# EAGLE design laser-jog-controller-0 (EAGLE 6.6.0)
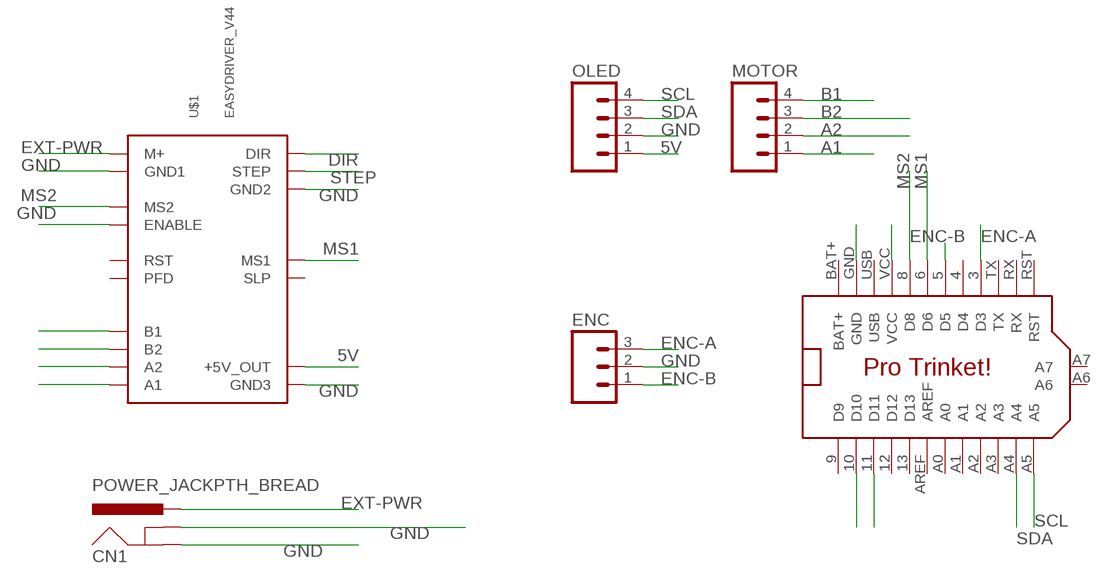
[diagram p0: schematic, sheet 1]

## Parts
CN1  POWER_JACKPTH_BREAD  [POWER_JACK_PTH_BREAD]
ENC  M03LOCK_LONGPADS  [1X03_LOCK_LONGPADS]
MOTOR  M04LOCK_LONGPADS  [1X04_LOCK_LONGPADS]
OLED  M04LOCK_LONGPADS  [1X04_LOCK_LONGPADS]
U$1  EASYDRIVER_V44  [EASYDRIVER_V44]
U$2  PRO_TRINKET  [PROTRINKET]

## Nets
5V: OLED.1 U$1.P$11(+5V_OUT) U$2.VCC
A1: MOTOR.1 U$1.A1
A2: MOTOR.2 U$1.A2
B1: MOTOR.4 U$1.B1
B2: MOTOR.3 U$1.B2
DIR: U$1.DIR U$2.11(D11)
ENC-A: ENC.3 U$2.3(D3)
ENC-B: ENC.1 U$2.5(D5)
EXT-PWR: CN1.PWR U$1.M+
GND: CN1.GND CN1.GNDBREAK ENC.2 OLED.2 U$1.ENABLE U$1.GND1 U$1.GND2 U$1.GND3 U$2.GND
MS1: U$1.MS1 U$2.6(D6)
MS2: U$1.MS2 U$2.8(D8)
SCL: OLED.4 U$2.A5
SDA: OLED.3 U$2.A4
STEP: U$1.STEP U$2.10(D10)
Unconnected: U$1.PFD U$1.RST U$1.SLEEP(SLP) U$2.4(D4) U$2.9(D9) U$2.12(D12) U$2.13(D13) U$2.A0 U$2.A1 U$2.A2 U$2.A3 U$2.A6 U$2.A7 U$2.AREF U$2.RST U$2.RX U$2.TX

## Power pins joined to a net without a drawn wire
BAT+: U$2.BAT+
USB: U$2.USB

## Library data of the parts
CN1 = SparkFun-Connectors:POWER_JACK: Power Jack This is the standard 5.5mm barrel jack for power. The PTH is the most common, proven, reliable, footprint. The Slot footprint only works if the mill layer is transmitted to the PCB fab house so be warned. Mating wall wart : TOL-00298 (and others); PROD_ID: PRT-10811
ENC = SparkFun-Connectors:M03: Header 3 Standard 3-pin 0.1" header. Use with straight break away headers (SKU : PRT-00116), right angle break away headers (PRT-00553), swiss pins (PRT-00743), machine pins (PRT-00117), and female headers (PRT-00115). Molex polarized connector foot print use with SKU : PRT-08232 with associated crimp pins and housings.
MOTOR OLED = SparkFun-Connectors:M04: Header 4 Standard 4-pin 0.1" header. Use with straight break away headers (SKU : PRT-00116), right angle break away headers (PRT-00553), swiss pins (PRT-00743), machine pins (PRT-00117), and female headers (PRT-00115). Molex polarized connector foot print use with SKU : PRT-08231 with associated crimp pins and housings. 1MM SMD Version SKU: PRT-10208
U$1 = EasyDriver:EASYDRIVER_V44: EasyDriver version 4.4 - http://www.schmalzhaus.com/EasyDriver
U$2 = adafruit:PRO_TRINKET

## Board
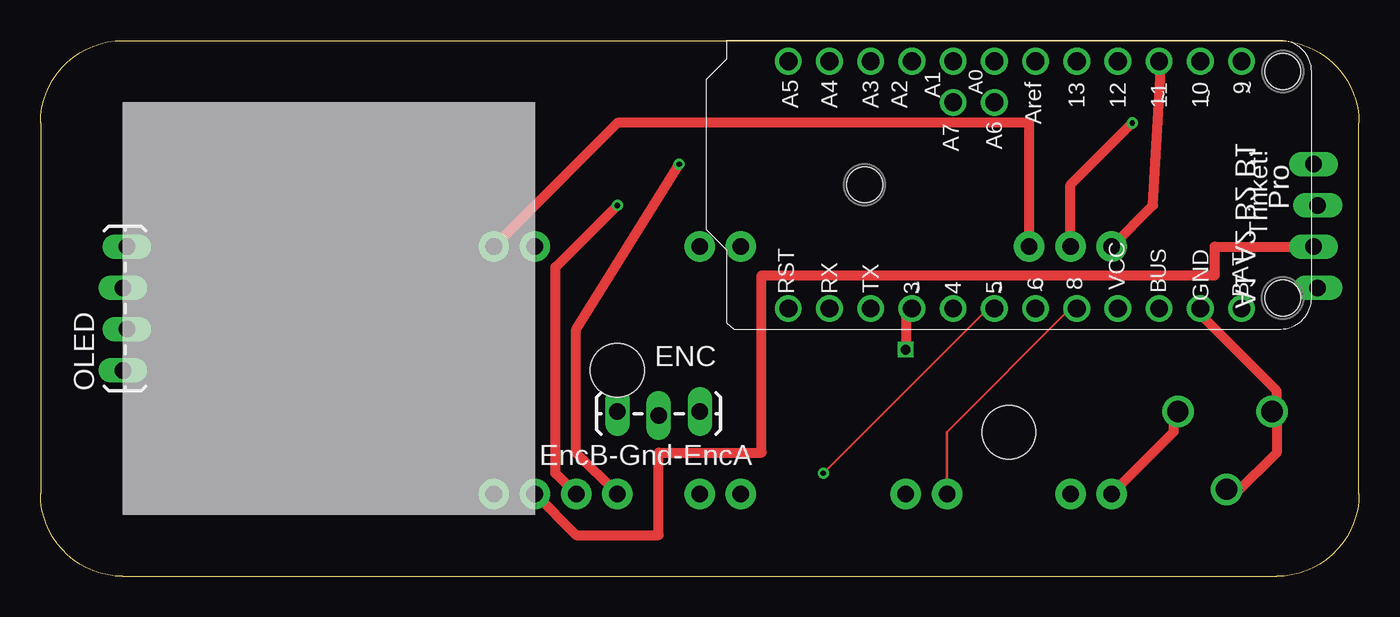
[diagram p1: board, top side]
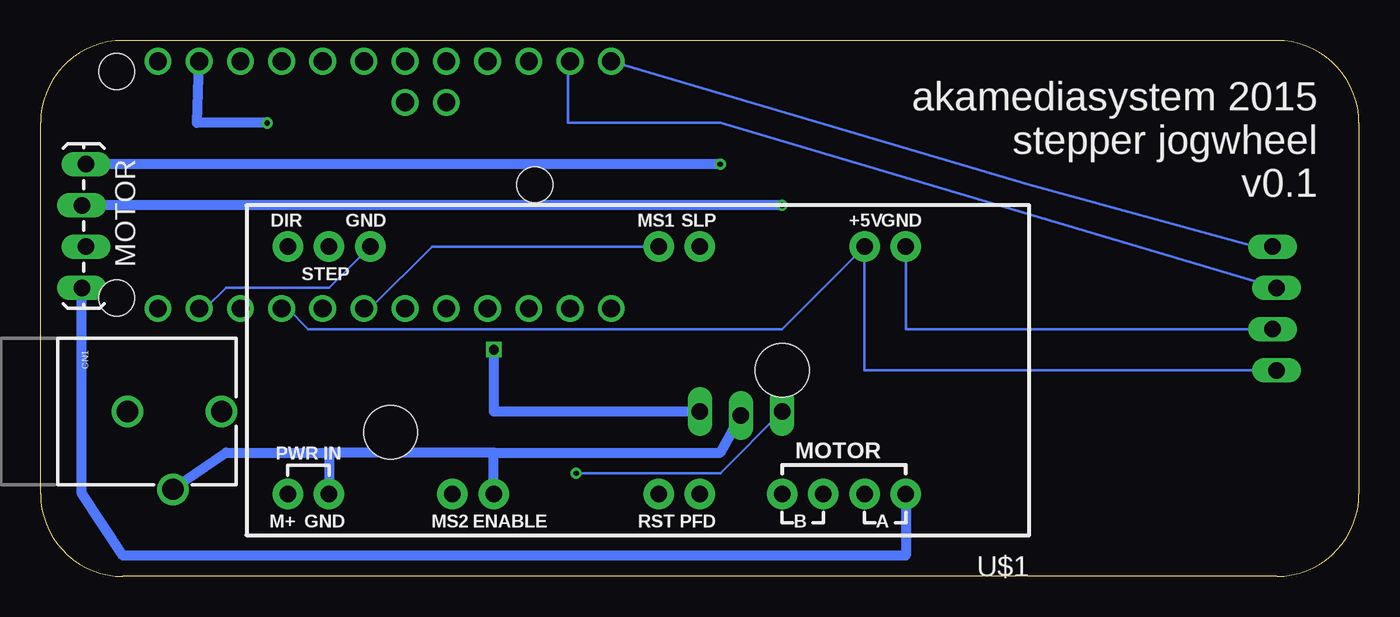
[diagram p2: board, bottom side, seen from below]

Size 81.28 x 33.02 mm. Coordinates in mm from the lower left corner, seen from the top.
Outline: 5.08,0 76.2,0 arc90 81.28,5.08 81.28,27.94 arc90 76.2,33.02 5.08,33.02 arc90 0,27.94 0,5.08 arc90 5.08,0
Copper layers (1*16): Top 0.0356mm / dielectric 1.5011mm / Bottom 0.0356mm
Design rules "LaenPCBOrder": minimum track width 6mil, minimum drill 13mil, track to track 6mil, track to pad 6mil, pad to pad 6mil, via to via 6mil, smd to smd 6mil, copper to edge 15mil, drill to drill 6mil, minimum pad ring 7mil, minimum via ring 7mil, stop-mask expansion 3mil, vias tented up to drill 0mil, thermal gap 10mil

### Footprints (pad centres in the part's own frame; a part is rotated, then mirrored left to right if it is on the bottom)
POWER_JACK_PTH_BREAD = drill 1.3: GND 0,7.9; GNDBREAK 4.8,10.7; PWR 0,13.7
1X03_LOCK_LONGPADS = drill 1.016 long: 1 0,0; 2 2.54,-0.254; 3 5.08,0
1X04_LOCK_LONGPADS = drill 1.016 long: 1 0,0; 2 2.54,-0.254; 3 5.08,0; 4 7.62,-0.254
EASYDRIVER_V44 = drill 1.016 pad 1.88: A1 -16.51,7.62; A2 -13.97,7.62; B1 -8.89,7.62; B2 -11.43,7.62; DIR 21.59,-7.62; ENABLE 8.89,7.62; GND1 19.05,7.62; GND2 16.51,-7.62; GND3 -16.51,-7.62; M+ 21.59,7.62; MS1 -1.27,-7.62; MS2 11.43,7.62; P$11 -13.97,-7.62; PFD -3.81,7.62; RST -1.27,7.62; SLEEP -3.81,-7.62; STEP 19.05,-7.62 | hole 3.302: 15.24,3.81; -8.89,0
PROTRINKET = drill 1.1: 3 7.62,2.921; 4 7.62,5.461; 5 7.62,8.001; 6 7.62,10.541; 8 7.62,13.081; 9 -7.62,23.241; 10 -7.62,20.701; 11 -7.62,18.161; 12 -7.62,15.621; 13 -7.62,13.081; A0 -7.62,8.001; A1 -7.62,5.461; A2 -7.62,2.921; A3 -7.62,0.381; A4 -7.62,-2.159; A5 -7.62,-4.699; A6 -5.08,8.001; A7 -5.08,5.461; AREF -7.62,10.541; BAT+ 7.62,23.241; GND 7.62,20.701; RST 7.62,-4.699; RX 7.62,-2.159; TX 7.62,0.381; USB 7.62,18.161; VCC 7.62,15.621 | hole 2.2: -6.985,25.781; 6.985,25.781; 0,0

### Placement (x,y rotation side)
CN1  83.82,10.16 270 bottom
ENC  35.56,10.16 0 top
MOTOR  78.74,17.78 90 bottom
OLED  5.08,12.7 90 top
U$1  44.45,12.7 180 bottom
U$2  50.8,24.13 270 top

### Tracks (layer width: path | path; a pad name or v marks a point on that pad's centre or on a via)
5V
  Bottom 0.152: OLED.1 30.48,12.7 U$1.P$11 35.56,15.24 64.77,15.24 66.04,16.51 U$2.VCC
A1
  Bottom 0.61: MOTOR.1 78.74,5.08 76.2,1.27 27.94,1.27 U$1.A1
A2
  Top 0.61: MOTOR.2 72.39,20.32 72.39,18.54 44.45,18.54 44.45,7.62 38.1,7.62 38.1,2.54 33.02,2.54 U$1.A2
B1  (via drill 0.33)
  Top 0.61: v39.37,25.4 33.02,15.24 33.02,7.62 U$1.B1
  Bottom 0.61: v39.37,25.4 MOTOR.4
B2  (via drill 0.33)
  Top 0.61: v35.56,22.86 31.75,19.05 31.75,6.35 U$1.B2
  Bottom 0.61: v35.56,22.86 MOTOR.3
DIR
  Top 0.61: U$1.DIR 68.58,22.86 69.09,31.75 U$2.11
ENC-A  (via drill 0.6)
  Top 0.61: U$2.3 53.34,16.51 v53.34,13.97
  Bottom 0.61: ENC.3 53.34,10.16 v53.34,13.97
ENC-B  (via drill 0.33)
  Top 0.152: v48.26,6.35 58.42,16.51 U$2.5
  Bottom 0.152: ENC.1 39.37,6.35 v48.26,6.35
EXT-PWR
  Top 0.61: U$1.M+ 69.85,8.89 69.85,10.16 CN1.PWR
GND
  Top 0.152: 71.12,16.51 U$2.GND
  Top 0.61: 71.12,16.51 76.2,11.43 76.2,10.16 | 76.2,10.16 76.2,7.62 73.66,5.08 CN1.GNDBREAK | 76.2,10.16 CN1.GND | U$1.GND3 35.56,27.94 60.96,27.94 U$1.GND2
  Bottom 0.152: OLED.2 27.94,15.24 U$1.GND3 | U$1.GND2 63.5,17.78 69.85,17.78 71.12,16.51 U$2.GND
  Bottom 0.61: 53.34,7.62 39.37,7.62 ENC.2 | U$1.ENABLE 53.34,7.62 | 53.34,7.62 63.5,7.62 | 63.5,7.62 U$1.GND1 | 63.5,7.62 69.85,7.62 CN1.GNDBREAK
MS1
  Bottom 0.152: U$1.MS1 57.15,20.32 60.96,16.51 U$2.6
MS2
  Top 0.152: U$1.MS2 55.88,8.89 63.5,16.51 U$2.8
SCL
  Bottom 0.152: U$2.A5 20.32,24.13 6.35,20.32 OLED.4
SDA
  Bottom 0.152: OLED.3 39.37,27.94 48.77,27.94 48.77,31.75 U$2.A4
STEP  (via drill 0.33)
  Top 0.61: v67.31,27.94 63.5,24.13 U$1.STEP
  Bottom 0.61: v67.31,27.94 71.63,27.94 U$2.10

### Text on the board
tNames: A1 A2 B2 B1 | EncB-Gnd-EncA
bNames: akamediasystem 2015 / stepper jogwheel / v0.1